# EAGLE design bt_relay2 (EAGLE 9.6.2)
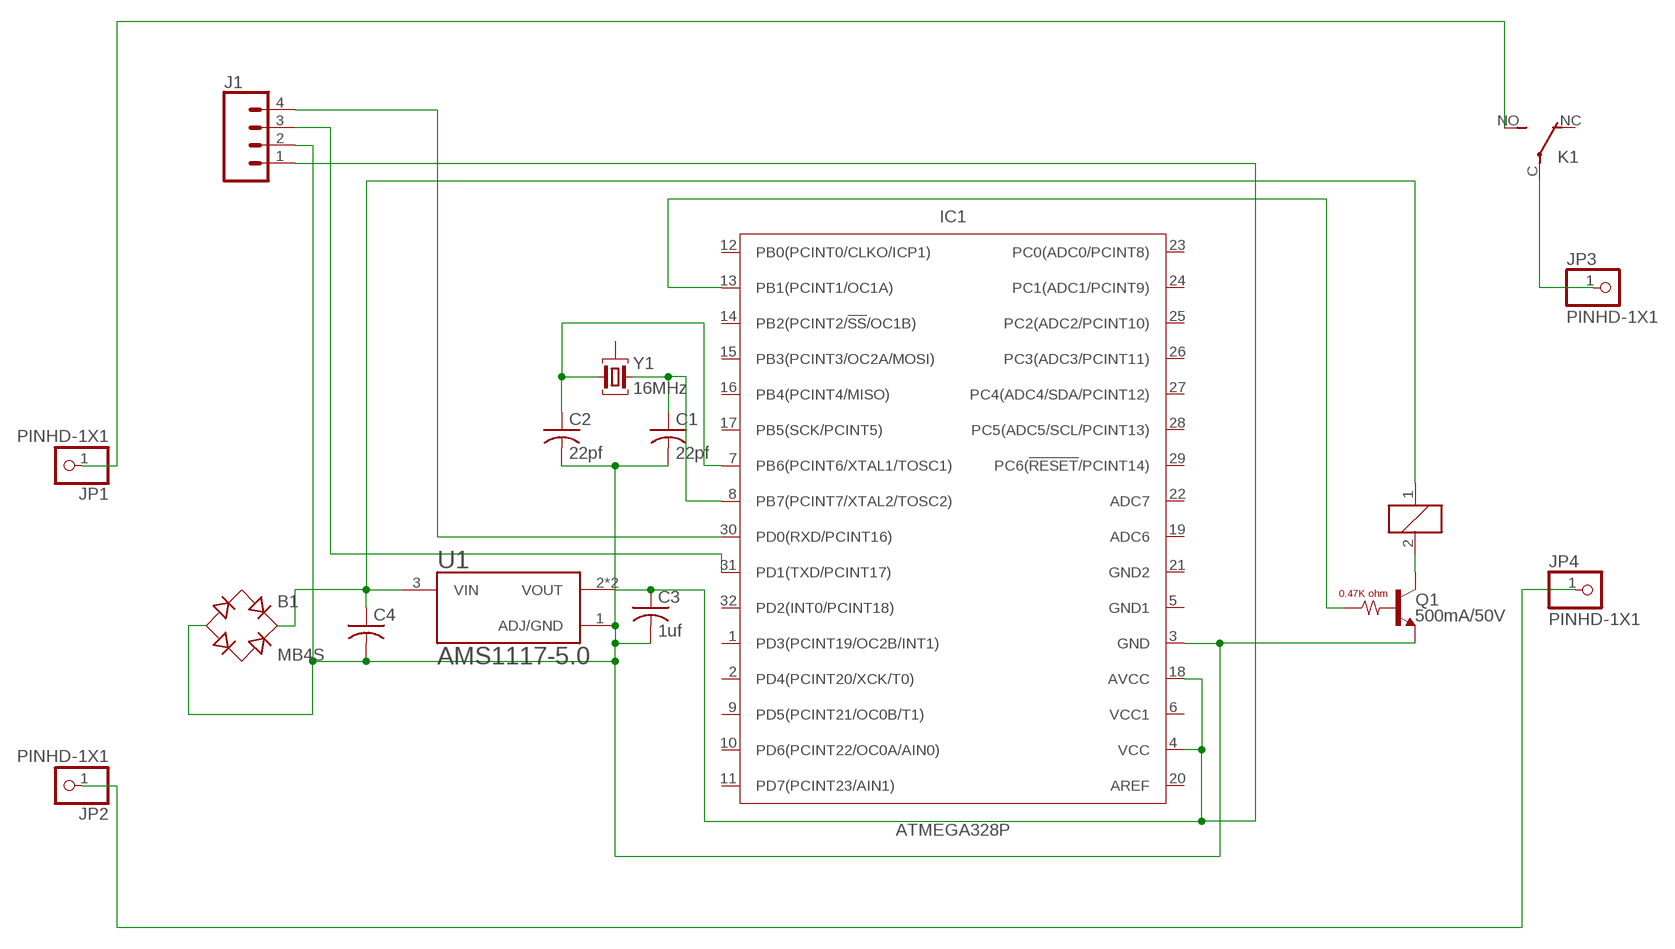
[diagram p0: schematic, sheet 1]

## Parts
B1  MB4S  [SOIC-4]
C1  22pf  C-USC0402  [C0402]
C2  22pf  C-USC0402  [C0402]
C3  1uf  C-USC0402  [C0402]
C4  C-USC0402  [C0402]
IC1  ATMEGA328P  ATMEGA328P_VQFN  [QFN50P500X500X90-33T310N]
J1  CONN_04  [1X04]
JP1  PINHD-1X1  [1X01]
JP2  PINHD-1X1  [1X01]
JP3  PINHD-1X1  [1X01]
JP4  PINHD-1X1  [1X01]
K1  CP1SA-12V  [CP1SA]
Q1  500mA/50V  TRANS_NPN_RES-DDTD142TC-7-F  [SOT23-3]
U1  AMS1117-5.0  [SOT229P700X180-4N]
Y1  16MHz  CRYSTAL_CMR200TB  [CRYSTAL_CMR200TB]

## Nets
N$1: C3.1 IC1.4(VCC) IC1.18(AVCC) J1.1 U1.2(VOUT) U1.4(VOUT)
N$2: B1.- C1.2 C2.2 C3.2 C4.2 IC1.3(GND) J1.2 Q1.2(E) U1.1(ADJ/GND)
N$3: B1.+ C4.1 K1.1 U1.3(VIN)
N$4: K1.2 Q1.3(C)
N$5: C2.1 IC1.7(PB6(PCINT6/XTAL1/TOSC1)) Y1.1
N$6: C1.1 IC1.8(PB7(PCINT7/XTAL2/TOSC2)) Y1.2
N$7: IC1.13(PB1(PCINT1/OC1A)) Q1.1(B)
N$9: JP3.1 K1.C(2:P)
N$10: JP1.1 K1.NO(2:S)
N$11: JP2.1 JP4.1
N$12: IC1.30(PD0(RXD/PCINT16)) J1.4
N$13: IC1.31(PD1(TXD/PCINT17)) J1.3
Unconnected: B1.~1(AC1) B1.~2(AC2) IC1.1(PD3(PCINT19/OC2B/INT1)) IC1.2(PD4(PCINT20/XCK/T0)) IC1.5(GND1) IC1.9(PD5(PCINT21/OC0B/T1)) IC1.10(PD6(PCINT22/OC0A/AIN0)) IC1.11(PD7(PCINT23/AIN1)) IC1.12(PB0(PCINT0/CLKO/ICP1)) IC1.14(PB2(PCINT2/!SS!/OC1B)) IC1.15(PB3(PCINT3/OC2A/MOSI)) IC1.16(PB4(PCINT4/MISO)) IC1.17(PB5(SCK/PCINT5)) IC1.19(ADC6) IC1.21(GND2) IC1.22(ADC7) IC1.23(PC0(ADC0/PCINT8)) IC1.24(PC1(ADC1/PCINT9)) IC1.25(PC2(ADC2/PCINT10)) IC1.26(PC3(ADC3/PCINT11)) IC1.27(PC4(ADC4/SDA/PCINT12)) IC1.28(PC5(ADC5/SCL/PCINT13)) IC1.29(PC6(!RESET!/PCINT14)) IC1.32(PD2(INT0/PCINT18)) K1.NC(2:O) Y1.3(G)

## Power pins joined to a net without a drawn wire
AREF: IC1.20(AREF)
VCC1: IC1.6(VCC1)

## Library data of the parts
B1 = rectifier:MB*S: Bridge Rectifier Source: http://www.fairchildsemi.com/ds/MB/MB6S.pdf
C1-C4 = BeagleBone_Black_Wireless:C-US: CAPACITOR, American symbol
IC1 = IC_Embedded:ATMEGA328P: 8-bit AVR Microcontroller with 32K Bytes In-System Programmable Flash Datasheet <http://ww1.microchip.com/downloads/en/DeviceDoc/Atmel-7810-Automotive-Microcontrollers-ATmega328P_Datasheet.pdf>; CATEGORY: IC_Embedded; MANUFACTURER: Microchip; MPN: ATmega328P-AU; OPERATING_TEMP: -40 to 85 °C; PART_STATUS: Active; SUB-CATEGORY: Microcontroller
J1 = SparkFun-Connectors:CONN_04: Multi connection point. Often used as Generic Header-pin footprint for 0.1 inch spaced/style header connections On any of the 0.1 inch spaced packages, you can populate with these: Break Away Headers - Straight <https://www.sparkfun.com/products/116> (PRT-00116) Break Away Male Headers - Right Angle <https://www.sparkfun.com/products/553> (PRT-00553) Female Headers <https://www.sparkfun.com/products/115> (PRT-00115) Break Away Headers - Machine Pin <https://www.sparkfun.com/products/117> (PRT-00117) Break Away Female Headers - Swiss Machine Pin <https://www.sparkfun.com/products/743> (PRT-00743) For SCREWTERMINALS and SPRING TERMINALS visit here: Screw Terimnals on SparkFun.com <https://www.sparkfun.com/search/results?term=Screw+Terminals> (5mm/3.5mm/2.54mm spacing) This device is also useful as a general connection point to wire up your design to another part of your project. Our various solder wires solder well into these plated through hole pads. Hook-Up Wire - Assortment (Stranded, 22 AWG) <https://www.sparkfun.com/products/11375> (PRT-11375) Hook-Up Wire - Assortment (Solid Core, 22 AWG) <https://www.sparkfun.com/products/11367> (PRT-11367) View the entire wire category on our website here <https://www.sparkfun.com/categories/141> Special notes: Molex polarized connector foot print use with SKU : PRT-08231 with associated crimp pins and housings. 1MM SMD Version SKU: PRT-10208; PROD_ID: CONN-09696
JP1-JP4 = Connector:PINHD-1X1: PIN HEADER; CATEGORY: CONNECTOR; SUB-CATEGORY: PIN-HEADER
K1 = relay:CP1?-*: ULTRA-MINIATURE LOW PROFILE AUTOMOTIVE RELAY NAiS Source: http://www.mew-europe.com/.. en_ds_61207_0000.pdf; MPN: CP1SA-12V-X; OC_FARNELL: unknown; OC_NEWARK: 96K2384
Q1 = SparkFun-DiscreteSemi:TRANS_NPN_RES: NPN transistor with built in base resistor Current controlled device with built in current control for tighter layouts. Link to datasheet <http://www.diodes.com/_files/datasheets/ds30399.pdf>. SparkFun Products: SparkFun OpenSegment Serial Display - White <https://www.sparkfun.com/products/11644> SparkFun OpenSegment Serial Display - Red <https://www.sparkfun.com/products/11644>; PROD_ID: TRANS-11480
U1 = AMS1117-5.0:AMS1117-5.0: Sot223/Pkg 1-Amp 5-Volt Low Drop Out Voltage Regulatator; AVAILABILITY: Unavailable; DESCRIPTION: Sot223/Pkg 1-Amp 5-Volt Low Drop Out Voltage Regulatator; MF: Advanced Monolithic Systems; MP: AMS1117-5.0; PACKAGE: None; PRICE: None
Y1 = 52101-101-REV-A_v16:CRYSTAL_CMR200TB: CRYSTAL Citizen CMR200T or Abrcon AB26TR Series

## Board
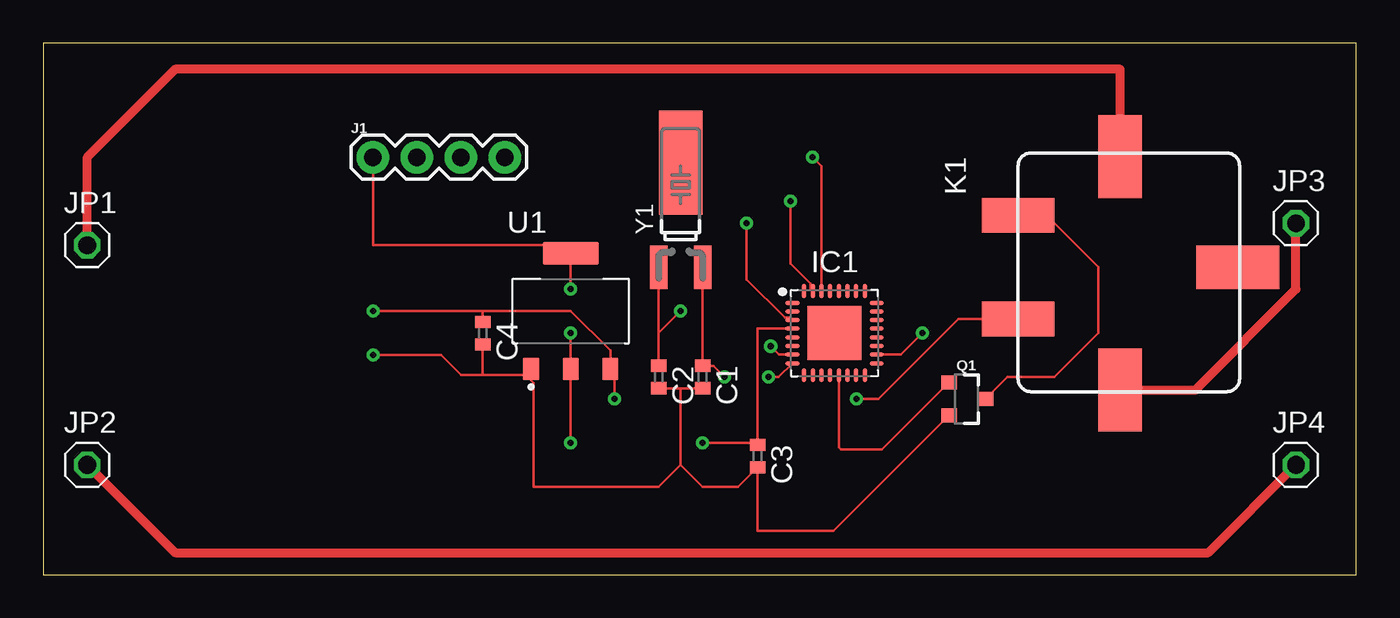
[diagram p1: board, top side]
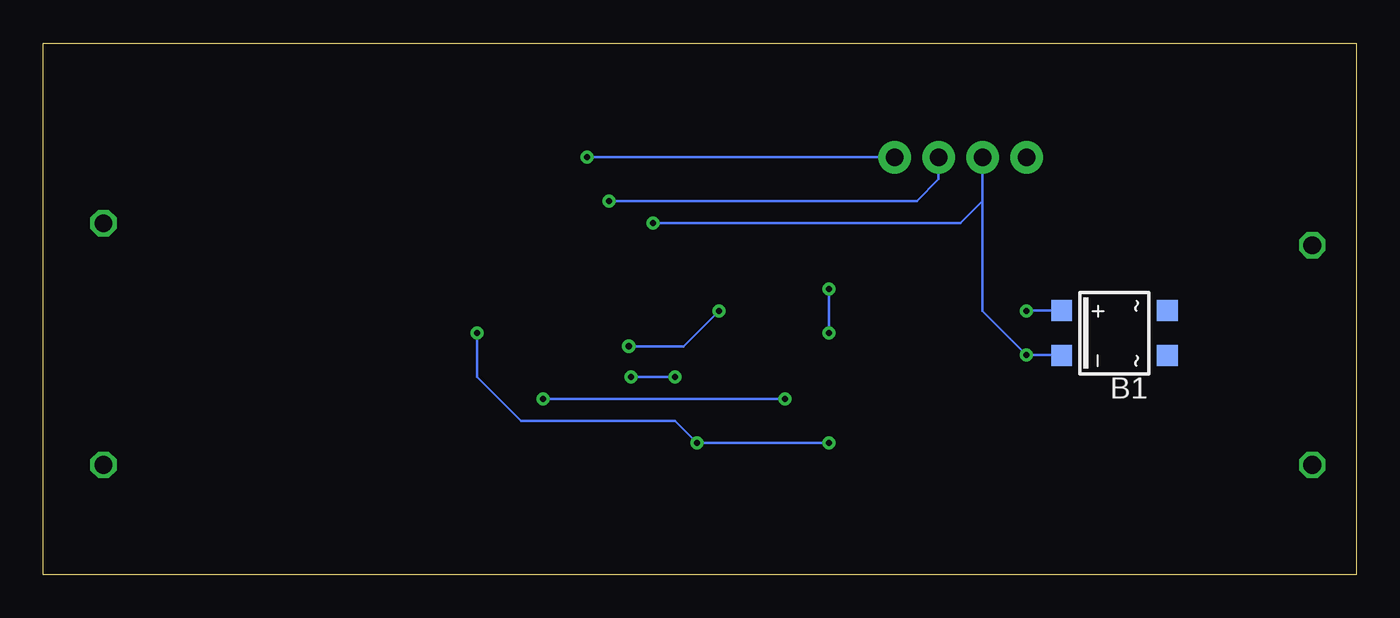
[diagram p2: board, bottom side, seen from below]

Size 75.87 x 30.72 mm. Coordinates in mm from the lower left corner, seen from the top.
Outline: 0,0 75.87,0 75.87,30.72 0,30.72 0,0
Copper layers (1*16): Top 0.035mm / dielectric 1.5mm / Bottom 0.035mm
Design rules "default": minimum track width 6mil, minimum drill 0.35mm, track to track 6mil, track to pad 6mil, pad to pad 6mil, via to via 6mil, smd to smd 6mil, copper to edge 40mil, drill to drill 6mil, minimum pad ring 10mil, minimum via ring 8mil, stop-mask expansion 4mil, vias tented up to drill 0mil, thermal gap 10mil

### Footprints (pad centres in the part's own frame; a part is rotated, then mirrored left to right if it is on the bottom)
SOIC-4 = smd 1.2 x 1.2: + 1.3,3.05; - -1.3,3.05; ~1 -1.3,-3.05; ~2 1.3,-3.05
C0402 = smd 0.7 x 0.9: 1 -0.65,0; 2 0.65,0
QFN50P500X500X90-33T310N = smd 0.837 x 0.264: 1 -2.437,1.75; 2 -2.437,1.25; 3 -2.437,0.75; 4 -2.437,0.25; 5 -2.437,-0.25; 6 -2.437,-0.75; 7 -2.437,-1.25; 8 -2.437,-1.75; 17 2.437,-1.75; 18 2.437,-1.25; 19 2.437,-0.75; 20 2.437,-0.25; 21 2.437,0.25; 22 2.437,0.75; 23 2.437,1.25; 24 2.437,1.75 | smd 0.264 x 0.837: 9 -1.75,-2.437; 10 -1.25,-2.437; 11 -0.75,-2.437; 12 -0.25,-2.437; 13 0.25,-2.437; 14 0.75,-2.437; 15 1.25,-2.437; 16 1.75,-2.437; 25 1.75,2.437; 26 1.25,2.437; 27 0.75,2.437; 28 0.25,2.437; 29 -0.25,2.437; 30 -0.75,2.437; 31 -1.25,2.437; 32 -1.75,2.437 | smd 3.1 x 3.1: 33 0,0
1X04 = drill 1.016 pad 1.88: 1 0,0; 2 2.54,0; 3 5.08,0; 4 7.62,0
1X01 = drill 1.016 octagon: 1 0,0
CP1SA = smd 2 x 4.2: 1 3,-5.9; 2 -3,-5.9 | smd 4.8 x 2.5: C 7.1,0; NO -6.4,0 | smd 2.5 x 4.8: NC 0,6.8
SOT23-3 = smd 0.8 x 0.9: 1 -0.95,-1; 2 0.95,-1; 3 0,1.1
SOT229P700X180-4N = smd 0.93 x 1.31: 1 -2.29,-3.345; 2 0,-3.345; 3 2.29,-3.345 | smd 3.24 x 1.31: 4 0,3.345
CRYSTAL_CMR200TB = smd 1 x 2.5: 1 -1.27,0; 2 1.27,0 | smd 2.5 x 6: 3 0,6.032

### Placement (x,y rotation side)
B1  13.97,13.97 90 bottom
C1  38.1,11.43 270 top
C2  35.56,11.43 270 top
C3  41.27,6.86 270 top
C4  25.4,13.97 270 top
IC1  45.72,13.97 0 top
J1  19.05,24.13 0 top
JP1  2.54,19.05 0 top
JP2  2.54,6.35 0 top
JP3  72.39,20.32 0 top
JP4  72.39,6.35 0 top
K1  62.23,17.78 270 top
Q1  53.34,10.16 270 top
U1  30.48,15.24 0 top
Y1  36.83,17.78 0 top

### Tracks (layer width: path | path; a pad name or v marks a point on that pad's centre or on a via)
N$1  (via drill 0.35)
  Top 0.152: J1.1 19.05,19.05 30.02,19.05 U1.4 v30.48,16.51 | v30.48,7.62 U1.2 v30.48,13.97 | v38.1,7.62 41.16,7.62 C3.1 41.27,14.22 IC1.4 | v50.8,13.97 49.55,12.72 IC1.18
  Bottom 0.152: v30.48,7.62 v38.1,7.62 39.37,8.89 48.26,8.89 50.8,11.43 v50.8,13.97 | v30.48,16.51 v30.48,13.97
N$2  (via drill 0.35)
  Top 0.152: v19.05,12.7 19.17,12.82 | C2.2 36.83,10.78 | 36.83,10.78 C1.2 | 36.83,6.35 38.1,5.08 40.15,5.08 C3.2 41.27,2.54 45.67,2.54 Q1.2 | 36.83,6.35 36.83,10.78 | U1.1 27.84,11.55 | 27.84,11.55 25.4,11.55 | 25.4,11.55 24.13,11.55 22.98,12.7 v19.05,12.7 | C4.2 25.4,11.55 | 27.84,11.55 28.32,11.07 28.32,5.08 35.56,5.08 36.83,6.35 | IC1.3 43.14,14.86 42.85,14.86 40.64,17.07 v40.64,20.32 | 19.11,12.64 v19.05,12.7
  Bottom 0.152: B1.- 16.51,12.16 16.51,12.7 v19.05,12.7 21.59,15.24 21.59,21.59 | 21.59,21.59 J1.2 | 21.59,21.59 22.86,20.32 v40.64,20.32
N$3  (via drill 0.35)
  Top 0.152: 25.4,15.24 30.48,15.24 32.77,12.95 U1.3 33.02,11.65 v33.02,10.16 | C4.1 25.4,15.24 | v46.99,10.16 48.26,10.16 52.88,14.78 K1.1 | 25.4,15.24 v19.05,15.24
  Bottom 0.152: v46.99,10.16 v33.02,10.16 | B1.+ 19.02,15.27 v19.05,15.24
N$4
  Top 0.152: Q1.3 55.71,11.43 58.42,11.43 60.96,13.97 60.96,17.78 57.96,20.78 K1.2
N$5  (via drill 0.35)
  Top 0.152: Y1.1 C2.1 35.56,13.97 v36.83,15.24 | v42.04,13.21 42.52,12.72 IC1.7
  Bottom 0.152: v36.83,15.24 38.86,13.21 v42.04,13.21
N$6  (via drill 0.35)
  Top 0.152: Y1.2 C1.1 38.72,12.08 v39.37,11.43 | v41.91,11.43 42.49,11.43 IC1.8
  Bottom 0.152: v39.37,11.43 v41.91,11.43
N$7
  Top 0.152: Q1.1 48.47,7.24 46.1,7.24 45.97,7.37 IC1.13
N$9
  Top 0.508: K1.C 66.56,10.68 72.39,16.51 JP3.1
N$10
  Top 0.508: JP1.1 2.54,24.13 7.62,29.21 62.23,29.21 K1.NO
N$11
  Top 0.508: JP2.1 7.62,1.27 67.31,1.27 JP4.1
N$12  (via drill 0.35)
  Top 0.152: IC1.30 44.97,23.61 v44.45,24.13
  Bottom 0.152: v44.45,24.13 J1.4
N$13  (via drill 0.35)
  Top 0.152: IC1.31 44.33,16.55 44.33,16.84 43.18,17.99 v43.18,21.59
  Bottom 0.152: J1.3 24.13,22.86 25.4,21.59 v43.18,21.59